# EasyEDA schematic SCH_uCompute_remote_2026-03-16.json
TITLE: Sheet_1; REV: 1.0; Date: 2026-03-13; Sheet: 1/1; Drawn By: JP; Company: Your Company
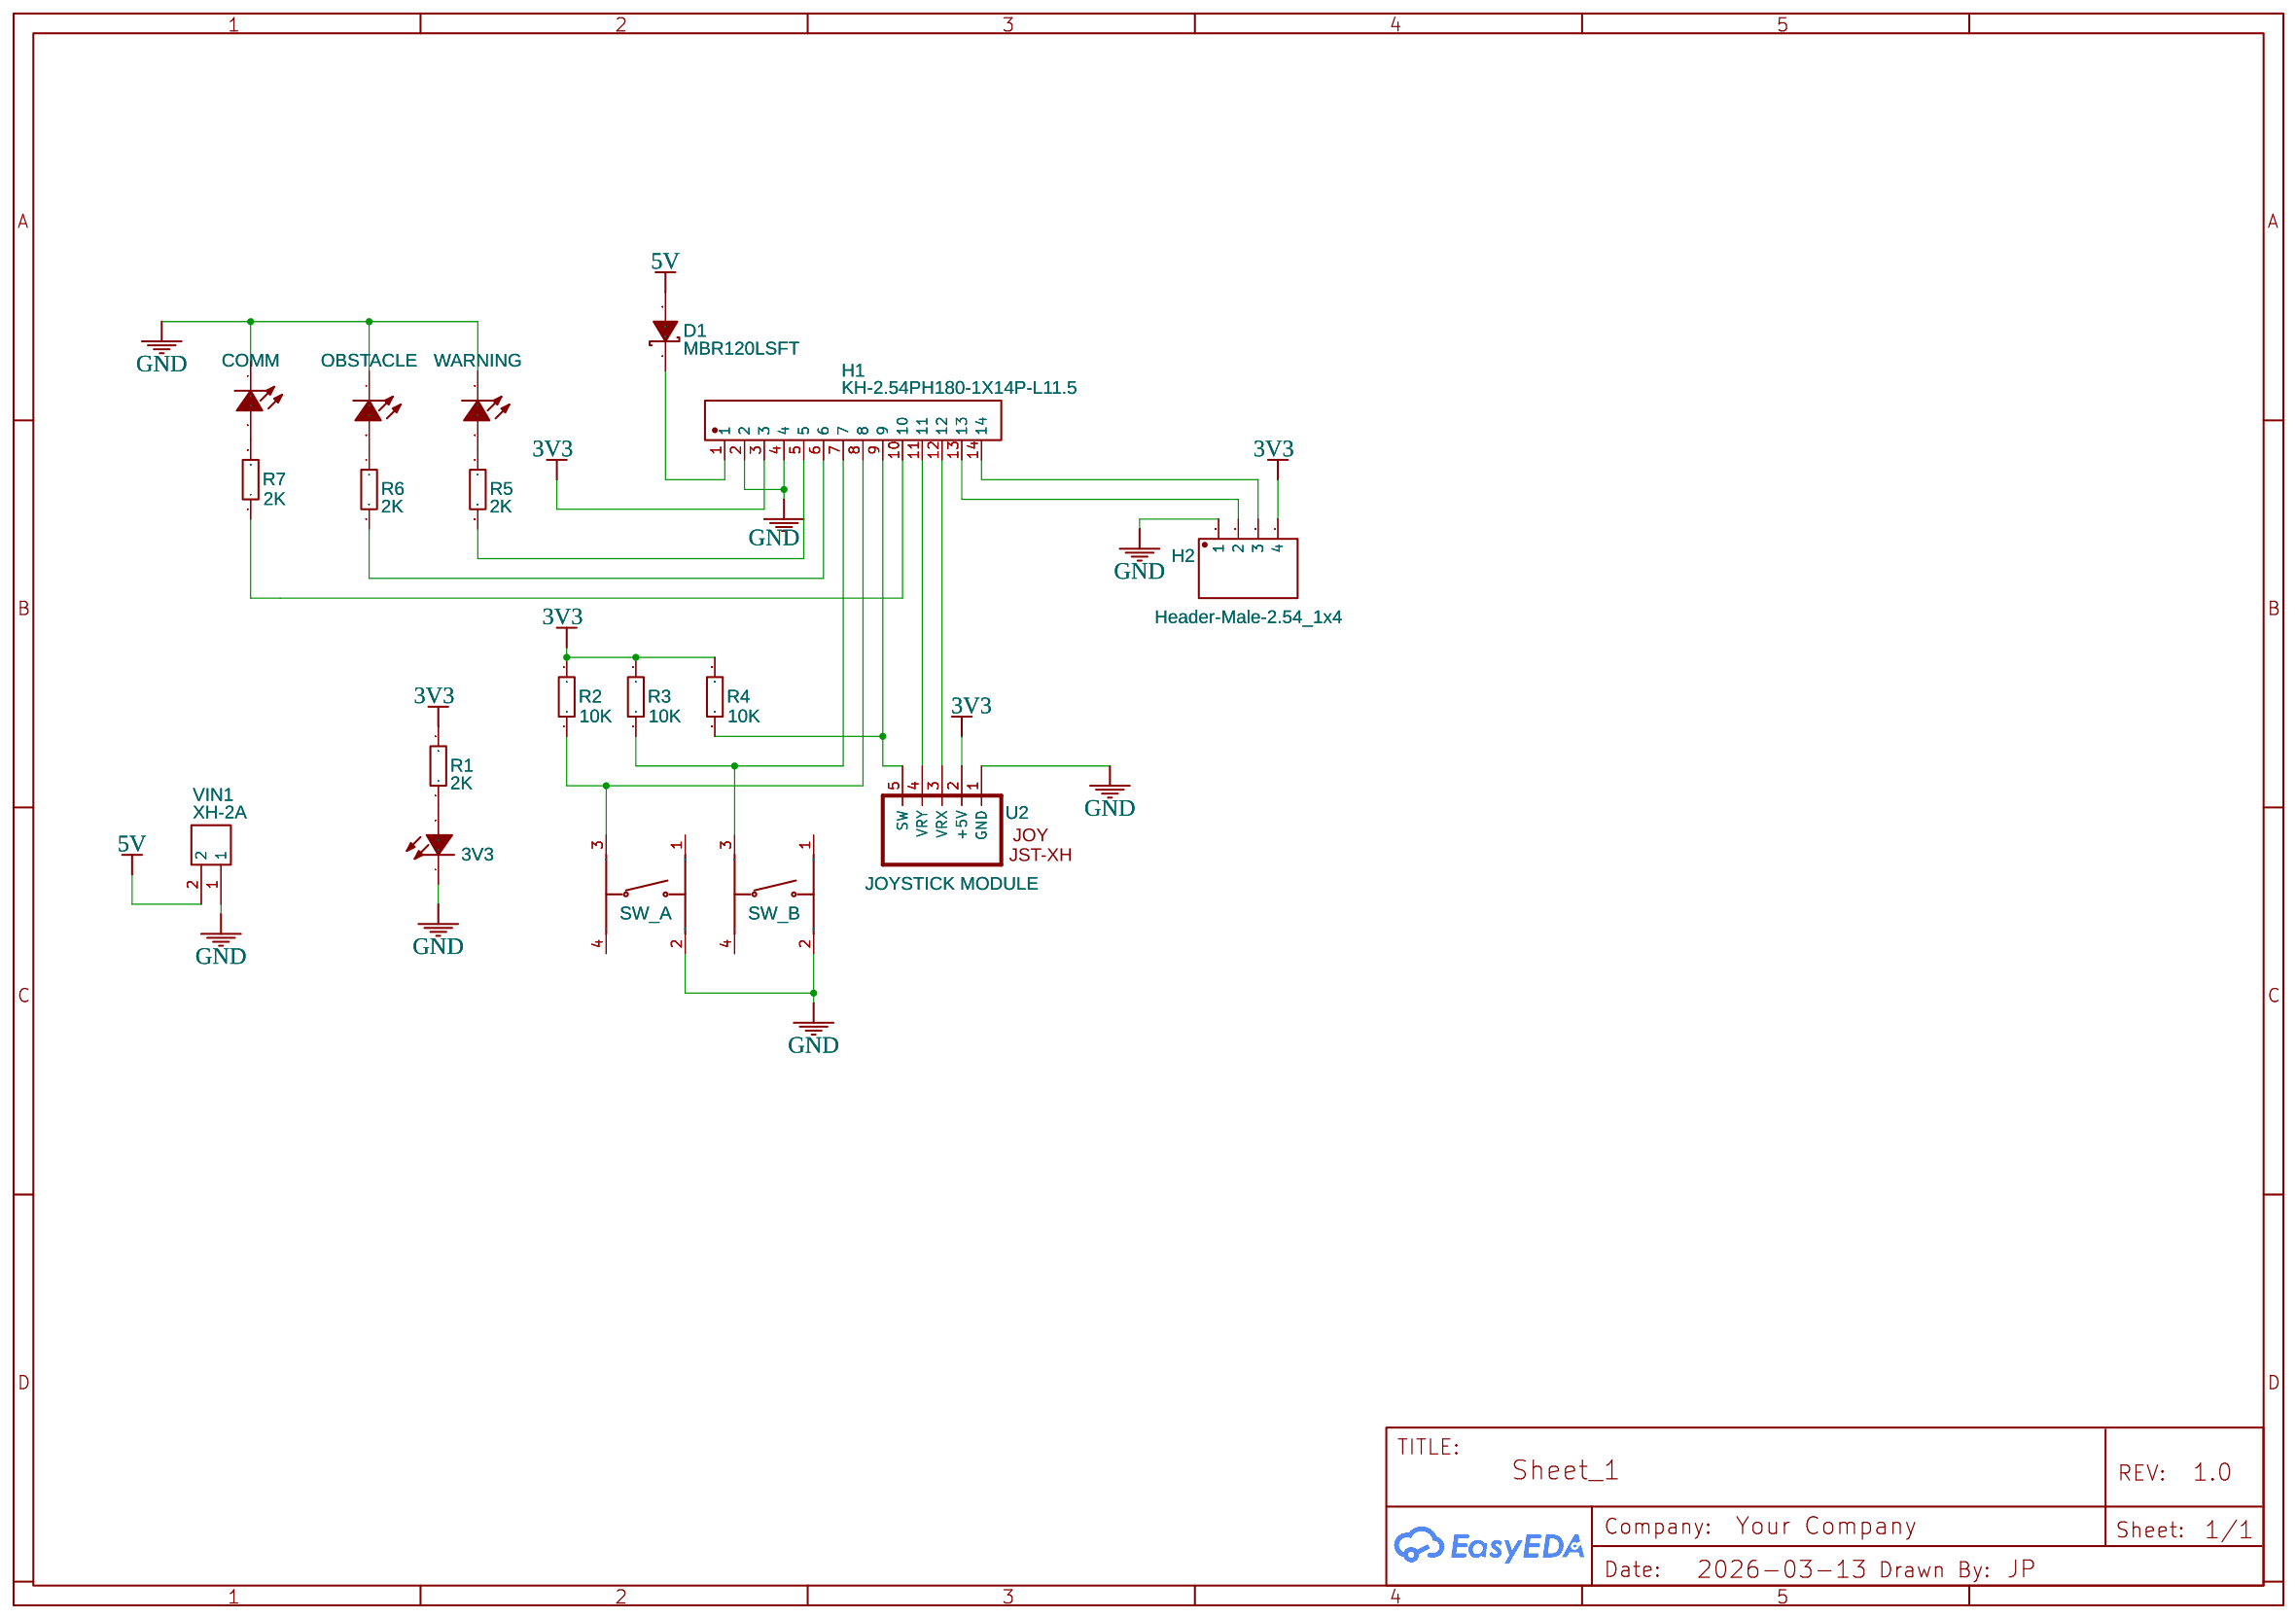
[diagram p0: schematic sheet]

## Parts
3V3  XL-1206QPC  [LED0805-RD_GREEN]
COMM  XL-1206QPC  [LED0805-RD_GREEN]
D1  MBR120LSFT  [DO-214AC_L4.3-W2.7-LS5.3-RD]
H1  KH-2.54PH180-1X14P-L11.5  [HDR-TH_14P-P2.54-V-M]
H2  Header-Male-2.54_1x4  [HDR-TH_4P-P2.54-V-M]
OBSTACLE  XL-1206QPC  [LED0805-RD_GREEN]
R1  2K  [R0805]
R2  10K  [R0805]
R3  10K  [R0805]
R4  10K  [R0805]
R5  2K  [R0805]
R6  2K  [R0805]
R7  2K  [R0805]
SW_A  12X12X7.3  [SW-TH_4P-L12.0-W12.0-P5.00-LS12.5]
SW_B  12X12X7.3  [SW-TH_4P-L12.0-W12.0-P5.00-LS12.5]
U2  JOYSTICK MODULE  [JOYSTICK ARDUINO MODULE]
VIN1  XH-2A  [CONN-TH_XH-2A]
WARNING  XL-1206QPC  [LED0805-RD_GREEN]

## Library data of the parts
3V3 COMM OBSTACLE WARNING = XL-1206QPC: Supplier: LCSC; Manufacturer: LCSC; Supplier Part: C10781; JLCPCB Part Class: Extended Part; Package Display: No
D1 = SS110A: Supplier: LCSC; Supplier Part: C211767; Manufacturer: Yangzhou Yangjie Elec Tech; Contributor: LCSC; JLCPCB Part Class: Extended Part
H1 = KH-2.54PH180-1X14P-L11.5: Contributor: LCSC; Supplier: LCSC; Supplier Part: C2905490; Manufacturer: kinghelm(金航标); JLCPCB Part Class: Extended Part
H2 = Header-Male-2.54_1x4: Contributor: LCSC; Supplier: LCSC; Manufacturer: Ckmtw(灿科盟); Manufacturer Part: B-2100S04P-A110; Supplier Part: C124378; JLCPCB Part Class: Extended Part
R1-R7 = RC0805DR-071KL: Supplier: LCSC; Manufacturer: YAGEO(国巨); Contributor: LCSC; Supplier Part: C100051; JLCPCB Part Class: Extended Part; Resistance: 1kΩ
SW_A SW_B = 12X12X7.3: Supplier: LCSC; Supplier Part: C10861; Manufacturer: BOOMELE(博穆精密); Manufacturer Part: 12x12x7.3 黄头; Contributor: LCSC; JLCPCB Part Class: Extended Part
U2 = JOYSTICK MODULE: Supplier: Core Electronics; Contributor: surades_siri
VIN1 = XH-2A: Supplier: LCSC; Manufacturer: BOOMELE(博穆精密); Supplier Part: C20079; JLCPCB Part Class: Extended Part

## Nets
3V3: H1.3 H2.4 R1.2 R2.2 R3.2 R4.2 U2.2(+5V)
5V: D1.2(A) VIN1.2
GND: 3V3.1(K) COMM.1(K) H1.2 H1.4 H2.1 OBSTACLE.1(K) SW_A.2 SW_B.2 U2.1(GND) VIN1.1 WARNING.1(K)
Net-(3V3-2): 3V3.2(A) R1.1
Net-(COMM-2): COMM.2(A) R7.2
Net-(D1-1): D1.1(K) H1.1
Net-(H1-5): H1.5 R5.2
Net-(H1-6): H1.6 R6.2
Net-(H1-7): H1.7 R3.1 SW_B.3
Net-(H1-8): H1.8 R2.1 SW_A.3
Net-(H1-9): H1.9 R4.1 U2.5(SW)
Net-(H1-10): H1.10 R7.1
Net-(H1-11): H1.11 U2.4(VRY)
Net-(H1-12): H1.12 U2.3(VRX)
Net-(H1-13): H1.13 H2.2
Net-(H1-14): H1.14 H2.3
Net-(OBSTACLE-2): OBSTACLE.2(A) R6.1
Net-(R5-1): R5.1 WARNING.2(A)

Not connected (* = marked no-connect by the designer): SW_A 1 4; SW_B 1 4
